# Altium schematic sheet digital.SchDoc
size A; SheetNumber: 1; SheetTotal: 1
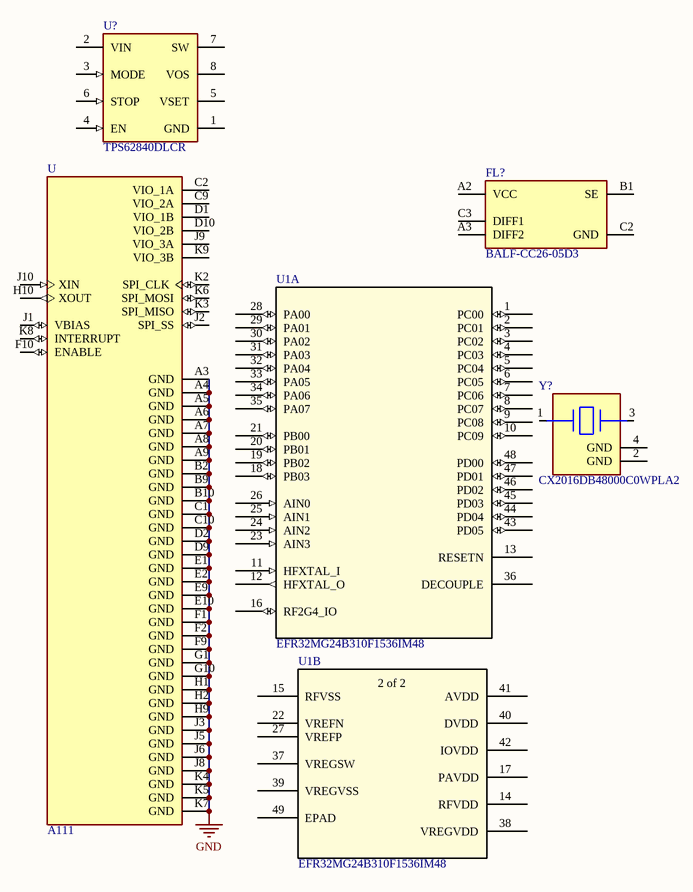
[diagram p0: digital.SchDoc]

## Parts
FL?  BALF-CC26-05D3  [FP-BALF-CC26-05D3-MFG]
U  A111  [BGA50N50P10X10_520X550X89N]
U1  EFR32MG24B310F1536IM48  [QFN48_0p4_6sq_SIL]  (parts A,B of 2)
U?  TPS62840DLCR  [FP-DLC0008B-MFG]
Y?  CX2016DB48000C0WPLA2  [FP-CX2016DB48000C0WPLA2-MFG]

## Nets
GND: U.A3(GND) U.A4(GND) U.A5(GND) U.A6(GND) U.A7(GND) U.A8(GND) U.A9(GND) U.B2(GND) U.B9(GND) U.B10(GND) U.C1(GND) U.C10(GND) U.D2(GND) U.D9(GND) U.E1(GND) U.E2(GND) U.E9(GND) U.E10(GND) U.F1(GND) U.F2(GND) U.F9(GND) U.G1(GND) U.G10(GND) U.H1(GND) U.H2(GND) U.H9(GND) U.J3(GND) U.J5(GND) U.J6(GND) U.J8(GND) U.K4(GND) U.K5(GND) U.K7(GND)

Not connected (* = marked no-connect by the designer): FL? A2(VCC) A3(DIFF2) B1(SE) C2(GND) C3(DIFF1); U C2(VIO_1A) C9(VIO_2A) D1(VIO_1B) D10(VIO_2B) F10(ENABLE) H10(XOUT) J1(VBIAS) J2(SPI_SS) J9(VIO_3A) J10(XIN) K2(SPI_CLK) K3(SPI_MISO) K6(SPI_MOSI) K8(INTERRUPT) K9(VIO_3B); U1 1(PC00) 2(PC01) 3(PC02) 4(PC03) 5(PC04) 6(PC05) 7(PC06) 8(PC07) 9(PC08) 10(PC09) 11(HFXTAL_I) 12(HFXTAL_O) 13(RESETN) 14(RFVDD) 15(RFVSS) 16(RF2G4_IO) 17(PAVDD) 18(PB03) 19(PB02) 20(PB01) 21(PB00) 22(VREFN) 23(AIN3) 24(AIN2) 25(AIN1) 26(AIN0) 27(VREFP) 28(PA00) 29(PA01) 30(PA02) 31(PA03) 32(PA04) 33(PA05) 34(PA06) 35(PA07) 36(DECOUPLE) 37(VREGSW) 38(VREGVDD) 39(VREGVSS) 40(DVDD) 41(AVDD) 42(IOVDD) 43(PD05) 44(PD04) 45(PD03) 46(PD02) 47(PD01) 48(PD00) 49(EPAD); U? 1(GND) 2(VIN) 3(MODE) 4(EN) 5(VSET) 6(STOP) 7(SW) 8(VOS); Y? 1(1_HOT) 2(GND) 3(2_HOT) 4(GND)

## Notes on the sheet
- (in symbol EFR32MG24B310F1536IM48, part B) 2 of 2

## Library data of the parts
FL? = CMP-12074-000001-1: BALUN 2.4GHZ-2.5GHZ 50/50 5UFBGA; Packaging: Cut Tape; RoHS Compliant: Yes; Mount: Surface Mount
U = A111: 110pF Â±5% 100V Ceramic Capacitor C0G, NP0 0805 _2012 Metric_; MF: acconeer; SnapEDA_Link: https://www.snapeda.com/parts/A111/acconeer/view-part/2777907/?ref=snap; Price: None; MP: A111; Value: *; Availability: Unavailable; Package: SMD-50 acconeer
U1 = EFR32MG24B310F1536IM48: No Description Available; Mfr_Name: Silicon Labs; Copyright: Copyright (C) 2022 Ultra Librarian. All rights reserved.; Manufacturer_Part_Number: EFR32MG24B310F1536IM48; RefDes: RefDes; Type: DEV
U? = CMP-04918-000086-1: ULTRA LOW IQ BUCK CONVERTER; Manufacturer: Texas Instruments; Standoff Height: 0mm; Nominal Supply Current: 0.005-3000uA; Switching Frequency: 1.8MHz; Max Duty Cycle: 100%; Min Supply Voltage: 1.8V; Output Current: 750mA; Max Supply Voltage: 6.5V; Max Junction Temp: +125°C; Output Type: AdjustableProgrammable; Output Voltage: 1.8-3.3V; Number Of Outputs: 1; Device Class L1: Integrated Circuits (ICs); Device Class L3: Voltage Regulators - Switching; RoHS: TRUE; Automotive: No; Package: DLC0008B; ComponentLink2URL: http://www.ti.com/lit/ds/symlink/tps62840.pdf; Height: 1mm; Lead Free: Yes; Octopart: https://octopart.com/tps62840dlcr-texas+instruments-103121111; Mouser Description: 60-nA IQ, 1.8-V to 6.5-VIN, high-efficiency 750-mA step-down converter 8-VSON-HR -40 to 125; Manufacturer Part Number: TPS62840DLCR; Ipc Land Pattern Name: DFN200X150X100-8; Temperature: -40°C to +125°C; ComponentLink2Description: Datasheet; Switching Topology: Buck; Temperature Range Low: -40°C; Device Class L2: Power Management ICs; Temperature Range High: +125°C; Digikey Description: ULTRA LOW IQ BUCK CONVERTER; Category: IC
Y? = CMP-20727-000003-1: CRYSTAL 48.0000MHZ 7PF SMD; Manufacturer: Kyocera; Tolerance: 20ppm; Esr: 22Ω; Frequency: 48000kHz; Height: 0.45mm; Load Capacitance: 7pF; Temperature: -40°C to +85°C; Automotive: No; Temperature Range High: +85°C; Octopart: https://octopart.com/cx2016db48000c0wpla2-avx+%2F+kyocera-52876167; Device Class L2: Crystals / Oscillators; Lead Free: Yes; Digikey Description: CRYSTAL 48.0000MHZ 7PF SMD; Mouser Description: Crystals 48MHz 7pF; Device Class L1: Passive Components; RoHS: TRUE; Temperature Range Low: -40°C; Package: 0; ComponentLink2Description: Datasheet; Device Class L3: Crystals; Series: CX2016DB; Category: Crys; ComponentLink2URL: https://global.kyocera.com/prdct/electro/product/pdf/cx2016db_e.pdf; Manufacturer Part Number: CX2016DB48000C0WPLA2